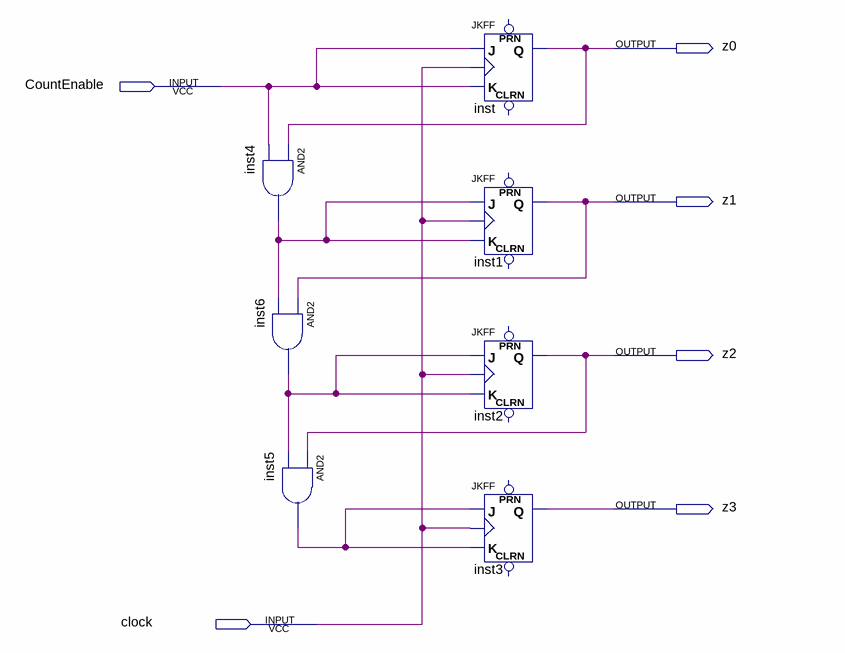
[diagram p0: schematic sheet]
// Quartus schematic counter.bdf as structural Verilog: 7 symbols, 6 pins
module counter (
  input  CountEnable,
  input  clock,
  output z0,
  output z1,
  output z2,
  output z3
);

  wire inst4_out, inst5_out, inst6_out;

  and inst4 (inst4_out, z0, CountEnable);
  and inst6 (inst6_out, z1, inst4_out);
  and inst5 (inst5_out, z2, inst6_out);
  JKFF inst (.K(CountEnable), .J(CountEnable), .CLK(clock), .Q(z0));  // open: PRN, CLRN
  JKFF inst1 (.K(inst4_out), .J(inst4_out), .CLK(clock), .Q(z1));  // open: PRN, CLRN
  JKFF inst2 (.K(inst6_out), .J(inst6_out), .CLK(clock), .Q(z2));  // open: PRN, CLRN
  JKFF inst3 (.K(inst5_out), .J(inst5_out), .CLK(clock), .Q(z3));  // open: PRN, CLRN
endmodule
